# EAGLE design mpcie-breakout (EAGLE 9.6.2)
VERSION: v3.1
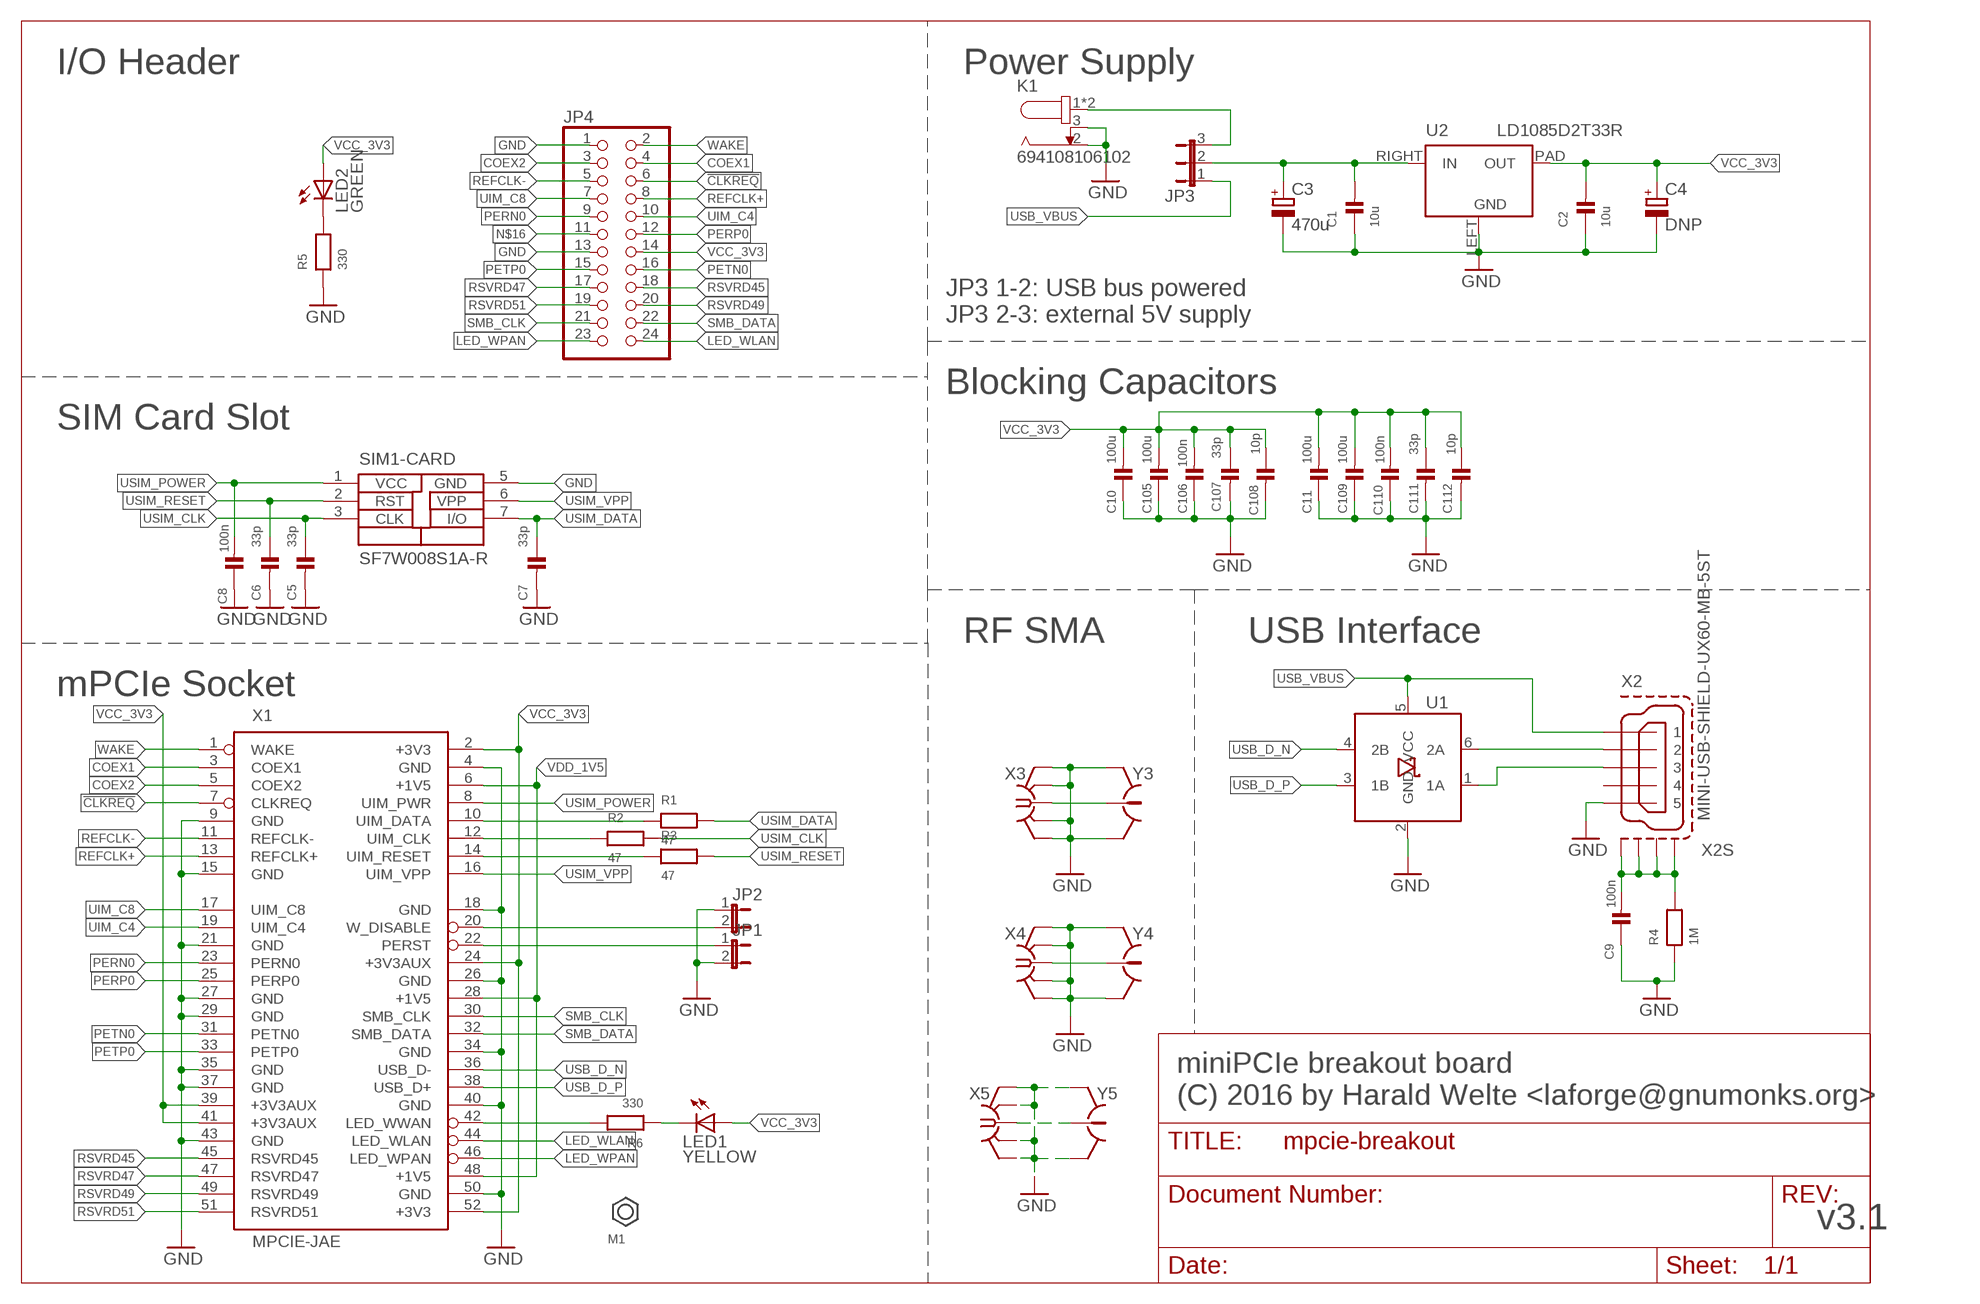
[diagram p0: schematic, sheet 1]
M1 (NUT): CLASS: MECHANICAL; DESCRIPTION: NO DESCRIPTION; LINK: http://www.digikey.com/product-detail/en/jae-electronics/MM60-EZH059-B5-R650/670-2277-1-ND; MANUFACTURER: UNKNOWN MANUFACTURER; MANUFACTURERPARTNUMBER: UNKNOWN MANUFACTURER PART NUMBER; OC_DIGIKEY: H9161CT-ND; POPULATED: TRUE; ROHSCERTIFICATE: UNKNOWN ROHS CERTIFICATE; SCHEM_BOM_ITEM: TRUE; SOURCE: DIGIKEY; SOURCEPARTNUMBER: A97593-ND

## Parts
C1  10u  CAP_CERAMIC_0805  [_0805]
C2  10u  CAP_CERAMIC_0805  [_0805]
C3  470u  CPOL-EUUD-8X10  [UD-8X10_NICHICON]
C4  DNP  CPOL-EUSMCE  [SMC_E]
C5  33p  CAP_CERAMIC_0402  [_0402]
C6  33p  CAP_CERAMIC_0402  [_0402]
C7  33p  CAP_CERAMIC_0402  [_0402]
C8  100n  CAP_CERAMIC_0603  [_0603]
C9  100n  CAP_CERAMIC_0603  [_0603]
C10  100u  CAP_CERAMIC1206  [1206]
C11  100u  CAP_CERAMIC1206  [1206]
C105  100u  CAP_CERAMIC1206  [1206]
C106  100n  CAP_CERAMIC_0603  [_0603]
C107  33p  CAP_CERAMIC_0402  [_0402]
C108  10p  CAP_CERAMIC_0603  [_0603]
C109  100u  CAP_CERAMIC1206  [1206]
C110  100n  CAP_CERAMIC_0603  [_0603]
C111  33p  CAP_CERAMIC_0402  [_0402]
C112  10p  CAP_CERAMIC_0603  [_0603]
JP1  JP1E  [JP1]
JP2  JP1E  [JP1]
JP3  JP2E  [JP2]
JP4  PINHD-2X12  [2X12]
K1  694108106102  [694108106102]
LED1  YELLOW  LEDCHIP-LED0603  [CHIP-LED0603]
LED2  GREEN  LEDCHIP-LED0603  [CHIP-LED0603]
R1  47  RESISTOR_0603  [_0603]
R2  47  RESISTOR_0603  [_0603]
R3  47  RESISTOR_0603  [_0603]
R4  1M  RESISTOR_0603  [_0603]
R5  330  RESISTOR_0603  [_0603]
R6  330  RESISTOR_0603  [_0603]
SIM1  SF7W008S1A-R  [SF7W008S1A-RESTR]
U1  IP4234CZ6  [TSOP-6]
U2  LD1085D2T33R  LDO-LD1085D2  [ST_D2PAK]
X1  MPCIE-JAE  [MM60-52]
X2  MINI-USB-SHIELD-UX60-MB-5ST  [UX60-MB-5ST]
X3  SMA-F-S-TH  [SMA-F-S-TH]
X4  SMA-F-S-TH  [SMA-F-S-TH]
X5  SMA-F-S-TH  [SMA-F-S-TH]
Y3  HRS_UFL  [HRS_UFL]
Y4  HRS_UFL  [HRS_UFL]
Y5  HRS_UFL  [HRS_UFL]

## Nets
!CLKREQ: JP4.6 X1.7(CLKREQ)
_USB_D_N [usb]: U1.6(2A) X2.2
_USB_D_P [usb]: U1.1(1A) X2.3
COEX1: JP4.4 X1.3(COEX1)
COEX2: JP4.3 X1.5(COEX2)
GND [supply]: C1.1 C2.1 C3.- C4.- C5.2 C6.2 C7.2 C8.1 C9.1 C10.1 C11.1 C105.1 C106.1 C107.2 C108.2 C109.1 C110.1 C111.2 C112.2 JP1.2 JP2.1 JP4.1 JP4.13 K1.2 K1.3 R4.1 R5.1 SIM1.5(-CARD:GND) U1.2(GND) U2.LEFT(GND) X1.4(GND) X1.9(GND) X1.15(GND) X1.18(GND) X1.21(GND) X1.26(GND) X1.27(GND) X1.29(GND) X1.34(GND) X1.35(GND) X1.37(GND) X1.40(GND) X1.43(GND) X1.50(GND) X2.5 X3.G1(GND) X3.G2(GND) X3.G3(GND) X3.G4(GND) X4.G1(GND) X4.G2(GND) X4.G3(GND) X4.G4(GND) X5.G1(GND) X5.G2(GND) X5.G3(GND) X5.G4(GND) Y3.GND@1(GND) Y3.GND@2(GND) Y4.GND@1(GND) Y4.GND@2(GND) Y5.GND@1(GND) Y5.GND@2(GND)
LDO_IN [supply]: C1.2 C3.+ JP3.2 U2.RIGHT(IN)
LED_WLAN: JP4.24 X1.44(LED_WLAN)
LED_WPAN: JP4.23 X1.46(LED_WPAN)
N$1: LED2.C R5.2
N$2: LED1.C R6.1
N$3: R6.2 X1.42(LED_WWAN)
N$5: R1.1 X1.10(UIM_DATA)
N$7 [50 ohm]: X5.C Y5.SIG
N$8: R2.1 X1.12(UIM_CLK)
N$9: R3.1 X1.14(UIM_RESET)
N$10: C9.2 R4.2 X2.M1(S1) X2.M2(S2) X2.M3(S3) X2.M4(S4)
N$12 [supply]: JP3.3 K1.1 K1.1-1
N$13 [50 ohm]: X3.C Y3.SIG
N$14 [50 ohm]: X4.C Y4.SIG
N$16: JP4.11
PERN0: JP4.9 X1.23(PERN0)
PERP0: JP4.12 X1.25(PERP0)
PERST: JP1.1 X1.22(PERST)
PETN0: JP4.16 X1.31(PETN0)
PETP0: JP4.15 X1.33(PETP0)
REFCLK+: JP4.8 X1.13(REFCLK+)
REFCLK-: JP4.5 X1.11(REFCLK-)
RSVRD45: JP4.18 X1.45(RSVRD45)
RSVRD47: JP4.17 X1.47(RSVRD47)
RSVRD49: JP4.20 X1.49(RSVRD49)
RSVRD51: JP4.19 X1.51(RSVRD51)
SMB_CLK: JP4.21 X1.30(SMB_CLK)
SMB_DATA: JP4.22 X1.32(SMB_DATA)
UIM_C4: JP4.10 X1.19(UIM_C4)
UIM_C8: JP4.7 X1.17(UIM_C8)
USB_D_N [usb]: U1.4(2B) X1.36(USB_D-)
USB_D_P [usb]: U1.3(1B) X1.38(USB_D+)
USB_VBUS [supply]: JP3.1 U1.5(VCC) X2.1
USIM_CLK: C5.1 R2.2 SIM1.3(-CARD:CLK)
USIM_DATA: C7.1 R1.2 SIM1.7(-CARD:I/O)
USIM_POWER [supply]: C8.2 SIM1.1(-CARD:VCC) X1.8(UIM_PWR)
USIM_RESET: C6.1 R3.2 SIM1.2(-CARD:RST)
USIM_VPP: SIM1.6(-CARD:VPP) X1.16(UIM_VPP)
VCC_3V3 [supply]: C2.2 C4.+ C10.2 C11.2 C105.2 C106.2 C107.1 C108.1 C109.2 C110.2 C111.1 C112.1 JP4.14 LED1.A LED2.A U2.PAD(OUT) X1.2(+3V3) X1.24(+3V3AUX) X1.39(+3V3AUX) X1.41(+3V3AUX) X1.52(+3V3)
VDD_1V5 [supply]: X1.6(+1V5) X1.28(+1V5) X1.48(+1V5)
W_DISABLE: JP2.2 X1.20(W_DISABLE)
WAKE: JP4.2 X1.1(WAKE)
Unconnected: SIM1.81 SIM1.82 X2.4

## Notes on the sheet
- I/O Header | Power Supply
- JP3 1-2: USB bus powered
  JP3 2-3: external 5V supply
- Blocking Capacitors
- SIM Card Slot
- RF SMA | USB Interface
- mPCIe Socket
- miniPCIe breakout board
  (C) 2016 by Harald Welte <laforge@gnumonks.org>

## Library data of the parts
C1 C2 = rc-sysmocom:CAP_CERAMIC: Ceramic Capacitors 0402 - 0402 Surface Mount Capacitors 16pF 50V 5% [Digikey: 445-4899-2-ND] 18pF 50V 5% [Digikey: 490-1281-2-ND] 22pF 50V 5% [Digikey: 490-1283-2-ND] 68pF 50V 5% [Digikey: 490-1289-2-ND] 0.1uF 10V 10% [Digikey: 490-1318-2-ND] 1.0uF 6.3V 10% [Digikey: 490-1320-2-ND] 0603 - 0603 Surface Mount Capacitors 16 pF 50V 5% [Digikey: 445-5051-2-ND] 22 pF 50V [Digikey: PCC220ACVTR-ND] 33 pF 50V 5% [Digikey: 490-1415-1-ND] 56pF 50V 5% [Digikey: 490-1421-1-ND] 220pF 50V 5% [Digikey: 445-1285-1-ND] 680 pF 50V 2200 pF 50V 5% C0G [Digikey: 445-1297-1-ND] 5600 pF 100V 5% X7R [Digikey: 478-3711-1-ND] 0.1 µF 25V 10% [Digikey: PCC2277TR-ND] 0.22 µF 16V 10% X7R [Digikey: 445-1318-1-ND] 1.0 µF 25V 10% [Digikey: 445-5146-2-ND] 0603 - RF Specific 3pF 250V +/-0.1pF RF [Digikey: 712-1347-1-ND] 18 pF 250V 5% [Digikey: 478-3505-1-ND or 712-1322-1-ND] 56 pF 250V 5% C0G RF [Digikey: 490-4867-1-ND] 68 pF 250V RF [Digikey: 490-4868-1-ND] 0805 - 0805 Surface Mount Capacitors 220 pF 250V 2% RF Ceramic Capacitor [Digikey: 712-1398-1-ND] 1000 pF 50V 2% NP0 Ceramic Capacitor [Digikey: 478-3760-1-ND] 0.1 µF 25V 10% Ceramic Capacitor [Digikey: PCC1828TR-ND] 1.0 µF 16V 10% Ceramic Capacitor[Digikey: 490-1691-2-ND] 10.0 µF 10V 10% Ceramic Capacitor[Digikey: 709-1228-1-ND] 10.0 uF 16V 10% Ceramic Capacitor [Digikey: 478-5165-2-ND] 47 uF 6.3V 20% Ceramic Capacitor [Digikey: 587-1779-1-ND or 399-5506-1-ND] 1206 - 1206 Surface Mount Capacitors 47uF 10V 20% Ceramic Capacitor [Digikey: 490-5528-1-ND or 399-5508-1-ND or 445-6010-1-ND] 100uF 6.3V -20%, +80% Y5V Ceramic Capacitor (Digikey: 490-4512-1-ND, Mouser: 81-GRM31CF50J107ZE1L) 1810 - 1810 Surface Mount Capacitors High volt MLC; no solder stop between for higher isolation; CLASS: CAPACITOR; DESCRIPTION: 10µF 16V Ceramic Capacitor X5R 0805 (2012 Metric) 0.079" L x 0.049" W (2.00mm x 1.25mm); LINK: http://www.digikey.com/product-detail/en/samsung-electro-mechanics-america-inc/CL21A106KOQNNNG/1276-6455-1-ND/5958083; MANUFACTURER: Samsung Electro-Mechanics America, Inc.; MANUFACTURERPARTNUMBER: CL21A106KOQNNNG; POPULATED: TRUE; ROHSCERTIFICATE: UNKNOWN ROHS CERTIFICATE; SOURCE: DIGIKEY; SOURCEPARTNUMBER: 1276-6455-1-ND
C3 = rcl:CPOL-EU: POLARIZED CAPACITOR, European symbol; CLASS: CAPACITOR; DESCRIPTION: 470µF 6.3V Aluminum Capacitors Radial, Can - SMD 2000 Hrs @ 85°C; LINK: http://www.digikey.com/product-detail/en/nichicon/UUR0J471MNL1GS/493-6207-1-ND/3438720; MANUFACTURER: Nichicon; MANUFACTURERPARTNUMBER: UUR0J471MNL1GS; POPULATED: TRUE; ROHSCERTIFICATE: UNKNOWN ROHS CERTIFICATE; SOURCE: DIGIKEY; SOURCEPARTNUMBER: 493-6207-1-ND
C4 = rcl:CPOL-EU: POLARIZED CAPACITOR, European symbol; CLASS: CAPACITOR; DESCRIPTION: NO DESCRIPTION; LINK: UNKNOWN LINK; MANUFACTURER: UNKNOWN MANUFACTURER; MANUFACTURERPARTNUMBER: UNKNOWN MANUFACTURER PART NUMBER; POPULATED: FALSE; ROHSCERTIFICATE: UNKNOWN ROHS CERTIFICATE; SOURCE: UNKNOWN SOURCE; SOURCEPARTNUMBER: UNKNOWN SOURCE PART NUMBER
C5-C7 C107 C111 = rc-sysmocom:CAP_CERAMIC: Ceramic Capacitors 0402 - 0402 Surface Mount Capacitors 16pF 50V 5% [Digikey: 445-4899-2-ND] 18pF 50V 5% [Digikey: 490-1281-2-ND] 22pF 50V 5% [Digikey: 490-1283-2-ND] 68pF 50V 5% [Digikey: 490-1289-2-ND] 0.1uF 10V 10% [Digikey: 490-1318-2-ND] 1.0uF 6.3V 10% [Digikey: 490-1320-2-ND] 0603 - 0603 Surface Mount Capacitors 16 pF 50V 5% [Digikey: 445-5051-2-ND] 22 pF 50V [Digikey: PCC220ACVTR-ND] 33 pF 50V 5% [Digikey: 490-1415-1-ND] 56pF 50V 5% [Digikey: 490-1421-1-ND] 220pF 50V 5% [Digikey: 445-1285-1-ND] 680 pF 50V 2200 pF 50V 5% C0G [Digikey: 445-1297-1-ND] 5600 pF 100V 5% X7R [Digikey: 478-3711-1-ND] 0.1 µF 25V 10% [Digikey: PCC2277TR-ND] 0.22 µF 16V 10% X7R [Digikey: 445-1318-1-ND] 1.0 µF 25V 10% [Digikey: 445-5146-2-ND] 0603 - RF Specific 3pF 250V +/-0.1pF RF [Digikey: 712-1347-1-ND] 18 pF 250V 5% [Digikey: 478-3505-1-ND or 712-1322-1-ND] 56 pF 250V 5% C0G RF [Digikey: 490-4867-1-ND] 68 pF 250V RF [Digikey: 490-4868-1-ND] 0805 - 0805 Surface Mount Capacitors 220 pF 250V 2% RF Ceramic Capacitor [Digikey: 712-1398-1-ND] 1000 pF 50V 2% NP0 Ceramic Capacitor [Digikey: 478-3760-1-ND] 0.1 µF 25V 10% Ceramic Capacitor [Digikey: PCC1828TR-ND] 1.0 µF 16V 10% Ceramic Capacitor[Digikey: 490-1691-2-ND] 10.0 µF 10V 10% Ceramic Capacitor[Digikey: 709-1228-1-ND] 10.0 uF 16V 10% Ceramic Capacitor [Digikey: 478-5165-2-ND] 47 uF 6.3V 20% Ceramic Capacitor [Digikey: 587-1779-1-ND or 399-5506-1-ND] 1206 - 1206 Surface Mount Capacitors 47uF 10V 20% Ceramic Capacitor [Digikey: 490-5528-1-ND or 399-5508-1-ND or 445-6010-1-ND] 100uF 6.3V -20%, +80% Y5V Ceramic Capacitor (Digikey: 490-4512-1-ND, Mouser: 81-GRM31CF50J107ZE1L) 1810 - 1810 Surface Mount Capacitors High volt MLC; no solder stop between for higher isolation; CLASS: CAPACITOR; DESCRIPTION: CAP CER 33PF 50V NP0 0402; LINK: http://www.digikey.com/product-detail/en/CL05C330JB5NNNC/1276-1272-1-ND/3889358; MANUFACTURER: Samsung Electro-Mechanics America, Inc.; MANUFACTURERPARTNUMBER: CL05C330JB5NNNC; POPULATED: TRUE; ROHSCERTIFICATE: Bleifrei / RoHS-konform; SOURCE: DIGIKEY; SOURCEPARTNUMBER: 1276-1272-1-ND
C8 C9 C106 C110 = rc-sysmocom:CAP_CERAMIC: Ceramic Capacitors 0402 - 0402 Surface Mount Capacitors 16pF 50V 5% [Digikey: 445-4899-2-ND] 18pF 50V 5% [Digikey: 490-1281-2-ND] 22pF 50V 5% [Digikey: 490-1283-2-ND] 68pF 50V 5% [Digikey: 490-1289-2-ND] 0.1uF 10V 10% [Digikey: 490-1318-2-ND] 1.0uF 6.3V 10% [Digikey: 490-1320-2-ND] 0603 - 0603 Surface Mount Capacitors 16 pF 50V 5% [Digikey: 445-5051-2-ND] 22 pF 50V [Digikey: PCC220ACVTR-ND] 33 pF 50V 5% [Digikey: 490-1415-1-ND] 56pF 50V 5% [Digikey: 490-1421-1-ND] 220pF 50V 5% [Digikey: 445-1285-1-ND] 680 pF 50V 2200 pF 50V 5% C0G [Digikey: 445-1297-1-ND] 5600 pF 100V 5% X7R [Digikey: 478-3711-1-ND] 0.1 µF 25V 10% [Digikey: PCC2277TR-ND] 0.22 µF 16V 10% X7R [Digikey: 445-1318-1-ND] 1.0 µF 25V 10% [Digikey: 445-5146-2-ND] 0603 - RF Specific 3pF 250V +/-0.1pF RF [Digikey: 712-1347-1-ND] 18 pF 250V 5% [Digikey: 478-3505-1-ND or 712-1322-1-ND] 56 pF 250V 5% C0G RF [Digikey: 490-4867-1-ND] 68 pF 250V RF [Digikey: 490-4868-1-ND] 0805 - 0805 Surface Mount Capacitors 220 pF 250V 2% RF Ceramic Capacitor [Digikey: 712-1398-1-ND] 1000 pF 50V 2% NP0 Ceramic Capacitor [Digikey: 478-3760-1-ND] 0.1 µF 25V 10% Ceramic Capacitor [Digikey: PCC1828TR-ND] 1.0 µF 16V 10% Ceramic Capacitor[Digikey: 490-1691-2-ND] 10.0 µF 10V 10% Ceramic Capacitor[Digikey: 709-1228-1-ND] 10.0 uF 16V 10% Ceramic Capacitor [Digikey: 478-5165-2-ND] 47 uF 6.3V 20% Ceramic Capacitor [Digikey: 587-1779-1-ND or 399-5506-1-ND] 1206 - 1206 Surface Mount Capacitors 47uF 10V 20% Ceramic Capacitor [Digikey: 490-5528-1-ND or 399-5508-1-ND or 445-6010-1-ND] 100uF 6.3V -20%, +80% Y5V Ceramic Capacitor (Digikey: 490-4512-1-ND, Mouser: 81-GRM31CF50J107ZE1L) 1810 - 1810 Surface Mount Capacitors High volt MLC; no solder stop between for higher isolation; CLASS: CAPACITOR; DESCRIPTION: CAP CER 0.1UF 16V 10% X7R 0603; LINK: http://www.digikey.com/product-detail/en/foo/1276-1005-1-ND; MANUFACTURER: Samsung Electro-Mechanics America, Inc; MANUFACTURERPARTNUMBER: CL10B104KO8NNNC; POPULATED: TRUE; ROHSCERTIFICATE: Bleifrei / RoHS-konform; SOURCE: DIGIKEY; SOURCEPARTNUMBER: 1276-1005-1-ND
C10 C11 C105 C109 = rc-sysmocom:CAP_CERAMIC: Ceramic Capacitors 0402 - 0402 Surface Mount Capacitors 16pF 50V 5% [Digikey: 445-4899-2-ND] 18pF 50V 5% [Digikey: 490-1281-2-ND] 22pF 50V 5% [Digikey: 490-1283-2-ND] 68pF 50V 5% [Digikey: 490-1289-2-ND] 0.1uF 10V 10% [Digikey: 490-1318-2-ND] 1.0uF 6.3V 10% [Digikey: 490-1320-2-ND] 0603 - 0603 Surface Mount Capacitors 16 pF 50V 5% [Digikey: 445-5051-2-ND] 22 pF 50V [Digikey: PCC220ACVTR-ND] 33 pF 50V 5% [Digikey: 490-1415-1-ND] 56pF 50V 5% [Digikey: 490-1421-1-ND] 220pF 50V 5% [Digikey: 445-1285-1-ND] 680 pF 50V 2200 pF 50V 5% C0G [Digikey: 445-1297-1-ND] 5600 pF 100V 5% X7R [Digikey: 478-3711-1-ND] 0.1 µF 25V 10% [Digikey: PCC2277TR-ND] 0.22 µF 16V 10% X7R [Digikey: 445-1318-1-ND] 1.0 µF 25V 10% [Digikey: 445-5146-2-ND] 0603 - RF Specific 3pF 250V +/-0.1pF RF [Digikey: 712-1347-1-ND] 18 pF 250V 5% [Digikey: 478-3505-1-ND or 712-1322-1-ND] 56 pF 250V 5% C0G RF [Digikey: 490-4867-1-ND] 68 pF 250V RF [Digikey: 490-4868-1-ND] 0805 - 0805 Surface Mount Capacitors 220 pF 250V 2% RF Ceramic Capacitor [Digikey: 712-1398-1-ND] 1000 pF 50V 2% NP0 Ceramic Capacitor [Digikey: 478-3760-1-ND] 0.1 µF 25V 10% Ceramic Capacitor [Digikey: PCC1828TR-ND] 1.0 µF 16V 10% Ceramic Capacitor[Digikey: 490-1691-2-ND] 10.0 µF 10V 10% Ceramic Capacitor[Digikey: 709-1228-1-ND] 10.0 uF 16V 10% Ceramic Capacitor [Digikey: 478-5165-2-ND] 47 uF 6.3V 20% Ceramic Capacitor [Digikey: 587-1779-1-ND or 399-5506-1-ND] 1206 - 1206 Surface Mount Capacitors 47uF 10V 20% Ceramic Capacitor [Digikey: 490-5528-1-ND or 399-5508-1-ND or 445-6010-1-ND] 100uF 6.3V -20%, +80% Y5V Ceramic Capacitor (Digikey: 490-4512-1-ND, Mouser: 81-GRM31CF50J107ZE1L) 1810 - 1810 Surface Mount Capacitors High volt MLC; no solder stop between for higher isolation; CLASS: CAPACITOR; DESCRIPTION: 100µF 6.3V Ceramic Capacitor X5R 1206 (3216 Metric) 0.126" L x 0.063" W (3.20mm x 1.60mm); LINK: http://www.digikey.com/product-detail/en/murata-electronics-north-america/GRM31CR60J107ME39K/490-7217-1-ND/3991203; MANUFACTURER: Murata Electronics North America; MANUFACTURERPARTNUMBER: GRM31CR60J107ME39K; POPULATED: TRUE; ROHSCERTIFICATE: UNKNOWN ROHS CERTIFICATE; SOURCE: DIGIKEY; SOURCEPARTNUMBER: 490-7217-1-ND
C108 C112 = rc-sysmocom:CAP_CERAMIC: Ceramic Capacitors 0402 - 0402 Surface Mount Capacitors 16pF 50V 5% [Digikey: 445-4899-2-ND] 18pF 50V 5% [Digikey: 490-1281-2-ND] 22pF 50V 5% [Digikey: 490-1283-2-ND] 68pF 50V 5% [Digikey: 490-1289-2-ND] 0.1uF 10V 10% [Digikey: 490-1318-2-ND] 1.0uF 6.3V 10% [Digikey: 490-1320-2-ND] 0603 - 0603 Surface Mount Capacitors 16 pF 50V 5% [Digikey: 445-5051-2-ND] 22 pF 50V [Digikey: PCC220ACVTR-ND] 33 pF 50V 5% [Digikey: 490-1415-1-ND] 56pF 50V 5% [Digikey: 490-1421-1-ND] 220pF 50V 5% [Digikey: 445-1285-1-ND] 680 pF 50V 2200 pF 50V 5% C0G [Digikey: 445-1297-1-ND] 5600 pF 100V 5% X7R [Digikey: 478-3711-1-ND] 0.1 µF 25V 10% [Digikey: PCC2277TR-ND] 0.22 µF 16V 10% X7R [Digikey: 445-1318-1-ND] 1.0 µF 25V 10% [Digikey: 445-5146-2-ND] 0603 - RF Specific 3pF 250V +/-0.1pF RF [Digikey: 712-1347-1-ND] 18 pF 250V 5% [Digikey: 478-3505-1-ND or 712-1322-1-ND] 56 pF 250V 5% C0G RF [Digikey: 490-4867-1-ND] 68 pF 250V RF [Digikey: 490-4868-1-ND] 0805 - 0805 Surface Mount Capacitors 220 pF 250V 2% RF Ceramic Capacitor [Digikey: 712-1398-1-ND] 1000 pF 50V 2% NP0 Ceramic Capacitor [Digikey: 478-3760-1-ND] 0.1 µF 25V 10% Ceramic Capacitor [Digikey: PCC1828TR-ND] 1.0 µF 16V 10% Ceramic Capacitor[Digikey: 490-1691-2-ND] 10.0 µF 10V 10% Ceramic Capacitor[Digikey: 709-1228-1-ND] 10.0 uF 16V 10% Ceramic Capacitor [Digikey: 478-5165-2-ND] 47 uF 6.3V 20% Ceramic Capacitor [Digikey: 587-1779-1-ND or 399-5506-1-ND] 1206 - 1206 Surface Mount Capacitors 47uF 10V 20% Ceramic Capacitor [Digikey: 490-5528-1-ND or 399-5508-1-ND or 445-6010-1-ND] 100uF 6.3V -20%, +80% Y5V Ceramic Capacitor (Digikey: 490-4512-1-ND, Mouser: 81-GRM31CF50J107ZE1L) 1810 - 1810 Surface Mount Capacitors High volt MLC; no solder stop between for higher isolation; CLASS: CAPACITOR; DESCRIPTION: CAP CER 10PF 50V NP0 0603; LINK: http://www.digikey.com/product-detail/en/C0603C100J5GACTU/399-1049-1-ND; MANUFACTURER: Kemet; MANUFACTURERPARTNUMBER: C0603C100J5GACTU; POPULATED: TRUE; ROHSCERTIFICATE: Bleifrei / RoHS-konform; SOURCE: DIGIKEY; SOURCEPARTNUMBER: 399-1049-1-ND
JP1 JP2 = jumper:JP1E: JUMPER; CLASS: CONNECTOR\JUMPER; DESCRIPTION: NO DESCRIPTION; LINK: UNKNOWN LINK; MANUFACTURER: UNKNOWN MANUFACTURER; MANUFACTURERPARTNUMBER: UNKNOWN MANUFACTURER PART NUMBER; POPULATED: TRUE; ROHSCERTIFICATE: UNKNOWN ROHS CERTIFICATE; SOURCE: UNKNOWN SOURCE; SOURCEPARTNUMBER: UNKNOWN SOURCE PART NUMBER
JP3 = jumper:JP2E: JUMPER; CLASS: CONNECTOR\JUMPER; DESCRIPTION: NO DESCRIPTION; LINK: UNKNOWN LINK; MANUFACTURER: UNKNOWN MANUFACTURER; MANUFACTURERPARTNUMBER: UNKNOWN MANUFACTURER PART NUMBER; POPULATED: TRUE; ROHSCERTIFICATE: UNKNOWN ROHS CERTIFICATE; SOURCE: UNKNOWN SOURCE; SOURCEPARTNUMBER: UNKNOWN SOURCE PART NUMBER
JP4 = pinhead:PINHD-2X12: PIN HEADER; CLASS: CONNECTOR\JUMPER; DESCRIPTION: 24 Positions Header, Unshrouded Connector 0.100" (2.54mm) Through Hole Gold; LINK: http://www.digikey.com/product-detail/en/961224-6404-AR/3M9463-ND/2071504; MANUFACTURER: 3M; MANUFACTURERPARTNUMBER: 961224-6404-AR; POPULATED: TRUE; ROHSCERTIFICATE: UNKNOWN ROHS CERTIFICATE; SOURCE: DIGIKEY; SOURCEPARTNUMBER: 3M9463-ND
K1 = Wurth_Elektronik_Electromechanic_DC_Power_Jack_Connectors_rev15c:694108106102: WR-DC_DC Power Jack_Right Angled_SMT Center Pin Ø2.5_Plug ID Ø2.55_Plug OD Ø5.5_with 4 Soldering Pad & Peg ;=>Code : Con_WR-DC_SMT_694108106102_694108106102 <http://katalog.we-online.de/media/images/eican/Con_WR-DC_SMT_694108106102_pf2.jpg> Details see: http://katalog.we-online.de/em/datasheet/6941xx106102.pdf Created 2014-10-08, Karrer Zheng 2014 (C) Wurth Elektronik; CLASS: RELAY; DESCRIPTION: Power Barrel Connector Jack 2.50mm ID (0.098"), 5.50mm OD (0.217") Surface Mount, Right Angle; LINK: http://www.digikey.com/product-detail/en/wurth-electronics-inc/694108106102/732-5933-1-ND/5047628; MANUFACTURER: Wurth Electronics Inc; MANUFACTURERPARTNUMBER: 694108106102; POPULATED: TRUE; ROHSCERTIFICATE: UNKNOWN ROHS CERTIFICATE; SOURCE: DIGIKEY; SOURCEPARTNUMBER: 732-5933-1-ND
LED1 LED2 = led:LED: LED OSRAM: - CHIPLED LG R971, LG N971, LY N971, LG Q971, LY Q971, LO R971, LY R971 LH N974, LH R974 LS Q976, LO Q976, LY Q976 LO Q996 - Hyper CHIPLED LW Q18S LB Q993, LB Q99A, LB R99A - SideLED LS A670, LO A670, LY A670, LG A670, LP A670 LB A673, LV A673, LT A673, LW A673 LH A674 LY A675 LS A676, LA A676, LO A676, LY A676, LW A676 LS A679, LY A679, LG A679 - Hyper Micro SIDELED® LS Y876, LA Y876, LO Y876, LY Y876 LT Y87S - SmartLED LW L88C, LW L88S LB L89C, LB L89S, LG L890 LS L89K, LO L89K, LY L89K LS L896, LA L896, LO L896, LY L896 - TOPLED LS T670, LO T670, LY T670, LG T670, LP T670 LSG T670, LSP T670, LSY T670, LOP T670, LYG T670 LG T671, LOG T671, LSG T671 LB T673, LV T673, LT T673, LW T673 LH T674 LS T676, LA T676, LO T676, LY T676, LB T676, LH T676, LSB T676, LW T676 LB T67C, LV T67C, LT T67C, LS T67K, LO T67K, LY T67K, LW E67C LS E67B, LA E67B, LO E67B, LY E67B, LB E67C, LV E67C, LT E67C LW T67C LS T679, LY T679, LG T679 LS T770, LO T770, LY T770, LG T770, LP T770 LB T773, LV T773, LT T773, LW T773 LH T774 LS E675, LA E675, LY E675, LS T675 LS T776, LA T776, LO T776, LY T776, LB T776 LHGB T686 LT T68C, LB T68C - Hyper Mini TOPLED® LB M676 - Mini TOPLED Santana® LG M470 LS M47K, LO M47K, LY M47K Source: http://www.osram.convergy.de LUXEON: - LUMILED® LXK2-PW12-R00, LXK2-PW12-S00, LXK2-PW14-U00, LXK2-PW14-V00 LXK2-PM12-R00, LXK2-PM12-S00, LXK2-PM14-U00 LXK2-PE12-Q00, LXK2-PE12-R00, LXK2-PE12-S00, LXK2-PE14-T00, LXK2-PE14-U00 LXK2-PB12-K00, LXK2-PB12-L00, LXK2-PB12-M00, LXK2-PB14-N00, LXK2-PB14-P00, LXK2-PB14-Q00 LXK2-PR12-L00, LXK2-PR12-M00, LXK2-PR14-Q00, LXK2-PR14-R00 LXK2-PD12-Q00, LXK2-PD12-R00, LXK2-PD12-S00 LXK2-PH12-R00, LXK2-PH12-S00 LXK2-PL12-P00, LXK2-PL12-Q00, LXK2-PL12-R00 Source: www.luxeon.com KINGBRIGHT: KA-3528ASYC Source: www.kingbright.com; CLASS: LED; DESCRIPTION: NO DESCRIPTION; LINK: UNKNOWN LINK; MANUFACTURER: UNKNOWN MANUFACTURER; MANUFACTURERPARTNUMBER: UNKNOWN MANUFACTURER PART NUMBER; POPULATED: TRUE; ROHSCERTIFICATE: UNKNOWN ROHS CERTIFICATE; SOURCE: UNKNOWN SOURCE; SOURCEPARTNUMBER: UNKNOWN SOURCE PART NUMBER
R1-R3 = rc-sysmocom:RESISTOR: Resistors 0402 - 0402 Surface Mount Package 22 Ohm 1% 1/16W [Digikey: 311-22.0LRTR-ND] 33 Ohm 5% 1/16W 1.0K 5% 1/16W 1.5K 5% 1/16W 2.0K 1% 1/16W 10.0K 1% 1/16W [Digikey: 311-10.0KLRTR-ND] 10.0K 5% 1/16W [Digikey: RMCF0402JT10K0TR-ND] 12.1K 1% 1/16W [Digikey: 311-22.0LRTR-ND] 100.0K 5% 1/16W 0603 - 0603 Surface Mount Package 1/10 Watt 0805 - 0805 Surface Mount Package 1/8 Watt 1206 - 1206 Surface Mount Package 2012 - 2010 Surface Mount Package 0.11 Ohm 1/2 Watt 1% Resistor - Digikey: RHM.11UCT-ND; CLASS: RESISTOR; DESCRIPTION: RES SMD 47 OHM 5% 1/10W 0603; LINK: http://www.digikey.com/product-detail/en/yageo/RC0603JR-0747RL/311-47GRCT-ND/729740; MANUFACTURER: Yageo; MANUFACTURERPARTNUMBER: RC0603JR-0747RL; POPULATED: TRUE; ROHSCERTIFICATE: UNKNOWN ROHS CERTIFICATE; SOURCE: DIGIKEY; SOURCEPARTNUMBER: 311-47GRCT-ND
R4 = rc-sysmocom:RESISTOR: Resistors 0402 - 0402 Surface Mount Package 22 Ohm 1% 1/16W [Digikey: 311-22.0LRTR-ND] 33 Ohm 5% 1/16W 1.0K 5% 1/16W 1.5K 5% 1/16W 2.0K 1% 1/16W 10.0K 1% 1/16W [Digikey: 311-10.0KLRTR-ND] 10.0K 5% 1/16W [Digikey: RMCF0402JT10K0TR-ND] 12.1K 1% 1/16W [Digikey: 311-22.0LRTR-ND] 100.0K 5% 1/16W 0603 - 0603 Surface Mount Package 1/10 Watt 0805 - 0805 Surface Mount Package 1/8 Watt 1206 - 1206 Surface Mount Package 2012 - 2010 Surface Mount Package 0.11 Ohm 1/2 Watt 1% Resistor - Digikey: RHM.11UCT-ND; CLASS: RESISTOR; DESCRIPTION: RES SMD 1M OHM 5% 1/10W 0603; LINK: http://www.digikey.com/product-detail/en/yageo/RC0603JR-071ML/311-1.0MGRCT-ND/729625; MANUFACTURER: Yageo; MANUFACTURERPARTNUMBER: RC0603JR-071ML; POPULATED: TRUE; ROHSCERTIFICATE: UNKNOWN ROHS CERTIFICATE; SOURCE: DIGIKEY; SOURCEPARTNUMBER: 311-1.0MGRCT-ND
R5 R6 = rc-sysmocom:RESISTOR: Resistors 0402 - 0402 Surface Mount Package 22 Ohm 1% 1/16W [Digikey: 311-22.0LRTR-ND] 33 Ohm 5% 1/16W 1.0K 5% 1/16W 1.5K 5% 1/16W 2.0K 1% 1/16W 10.0K 1% 1/16W [Digikey: 311-10.0KLRTR-ND] 10.0K 5% 1/16W [Digikey: RMCF0402JT10K0TR-ND] 12.1K 1% 1/16W [Digikey: 311-22.0LRTR-ND] 100.0K 5% 1/16W 0603 - 0603 Surface Mount Package 1/10 Watt 0805 - 0805 Surface Mount Package 1/8 Watt 1206 - 1206 Surface Mount Package 2012 - 2010 Surface Mount Package 0.11 Ohm 1/2 Watt 1% Resistor - Digikey: RHM.11UCT-ND; CLASS: RESISTOR; DESCRIPTION: RES SMD 330 OHM 5% 1/10W 0603; LINK: http://www.digikey.com/product-detail/en/yageo/RC0603JR-07330RL/311-330GRCT-ND/729716; MANUFACTURER: Yageo; MANUFACTURERPARTNUMBER: RC0603JR-07330RL; POPULATED: TRUE; ROHSCERTIFICATE: UNKNOWN ROHS CERTIFICATE; SOURCE: DIGIKEY; SOURCEPARTNUMBER: 311-330GRCT-ND
SIM1 = SF7W008S1A-SIM:SF7W008S1A: JAE SIM card holder with lock and card detect switch; CLASS: UNKNOWN CLASS; DESCRIPTION: 8 (6 + 2) Position Card Connector SIM Card Surface Mount, Right Angle Gold; LINK: http://www.digikey.com/product-detail/en/jae-electronics/SF7W008S1AE900/670-2337-1-ND/1284033; MANUFACTURER: JAE Electronics; MANUFACTURERPARTNUMBER: SF7W008S1AE900; OC_DIGIKEY: 670-2337-1-ND; POPULATED: TRUE; ROHSCERTIFICATE: UNKNOWN ROHS CERTIFICATE; SOURCE: DIGIKEY; SOURCEPARTNUMBER: 670-2337-1-ND
U1 = laforge:IP4234CZ6: NXP IP4234CZ6 - Single USB 2.0 ESD protection to IEC 61000-4-2 level 4; CLASS: IC; DESCRIPTION: TVS DIODE 5.5VWM 6TSOP; LINK: http://www.digikey.com/product-detail/en/nxp-semiconductors/IP4234CZ6,125/568-5869-1-ND/2531156; MANUFACTURER: NXP Semiconductors; MANUFACTURERPARTNUMBER: IP4234CZ6,125; OC_DIGIKEY: 568-5869-1-ND; POPULATED: TRUE; ROHSCERTIFICATE: UNKNOWN ROHS CERTIFICATE; SOURCE: DIGIKEY; SOURCEPARTNUMBER: 568-5869-1-ND
U2 = ldo:LDO; CLASS: IC; DESCRIPTION: Linear Voltage Regulator IC Positive Fixed 1 Output 3.3V 3A D2PAK; LINK: http://www.digikey.com/product-detail/en/stmicroelectronics/LD1085D2T33R/497-1222-1-ND/586222; MANUFACTURER: STMicroelectronics; MANUFACTURERPARTNUMBER: LD1085D2T33R; POPULATED: TRUE; ROHSCERTIFICATE: UNKNOWN ROHS CERTIFICATE; SOURCE: DIGIKEY; SOURCEPARTNUMBER: 497-1222-1-ND
X1 = con-miniPCIe:MPCIE; CLASS: CONNECTOR; DESCRIPTION: CONN MINI EXPRESS CARD 52POS SMD; LINK: http://www.digikey.com/product-detail/en/jae-electronics/MM60-52B1-E1-R650/670-2275-1-ND; MANUFACTURER: JAE Electronics; MANUFACTURERPARTNUMBER: MM60-52B1-E1-R650; POPULATED: TRUE; ROHSCERTIFICATE: UNKNOWN ROHS CERTIFICATE; SOURCE: DIGIKEY; SOURCEPARTNUMBER: 670-2275-1-ND
X2 = con-hirose:MINI-USB-SHIELD-: MINI USB Connector Source: http://www.hirose.co.jp/cataloge_hp/e24000019.pdf; CLASS: CONNECTOR; DESCRIPTION: USB - mini B USB 2.0 Receptacle Connector 5 Position Surface Mount, Right Angle, Horizontal; LINK: http://www.digikey.com/product-detail/en/hirose-electric-co-ltd/UX60-MB-5ST/H2959CT-ND/597538; MANUFACTURER: Hirose Electric Co Ltd; MANUFACTURERPARTNUMBER: UX60-MB-5ST; OC_FARNELL: unknown; OC_NEWARK: unknown; POPULATED: TRUE; ROHSCERTIFICATE: UNKNOWN ROHS CERTIFICATE; SOURCE: DIGIKEY; SOURCEPARTNUMBER: H2959CT-ND
X3-X5 = laforge:SMA-F; CLASS: CONNECTOR; DESCRIPTION: CONN SMA JACK STR 50 OHM PCB; LINK: http://www.digikey.com/product-detail/en/te-connectivity-amp-connectors/5-1814832-1/A97594-ND/1755982; MANUFACTURER: TE Connectivity AMP Connectors; MANUFACTURERPARTNUMBER: 5-1814832-1; POPULATED: TRUE; ROHSCERTIFICATE: UNKNOWN ROHS CERTIFICATE; SOURCE: DIGIKEY; SOURCEPARTNUMBER: A97594-ND
Y3-Y5 = laforge:HRS_UFL: Hirose U.FL SMT; CLASS: UNKNOWN CLASS; DESCRIPTION: CONN UMC RCPT STR 50 OHM SMD; LINK: http://www.digikey.com/product-detail/en/hirose-electric-co-ltd/U.FL-R-SMT(01)/H9161-ND/513010; MANUFACTURER: Hirose Electric Co Ltd; MANUFACTURERPARTNUMBER: U.FL-R-SMT(01); OC_DIGIKEY: H9161CT-ND; POPULATED: TRUE; ROHSCERTIFICATE: UNKNOWN ROHS CERTIFICATE; SOURCE: DIGIKEY; SOURCEPARTNUMBER: H9161-ND

## Net classes
1 usb: width 0.5 mm, drill 0.15 mm
2 50 ohm: width 0.9 mm, clearance 0.152 mm
3 supply: width 0.6 mm, clearance 0.203 mm

## Board
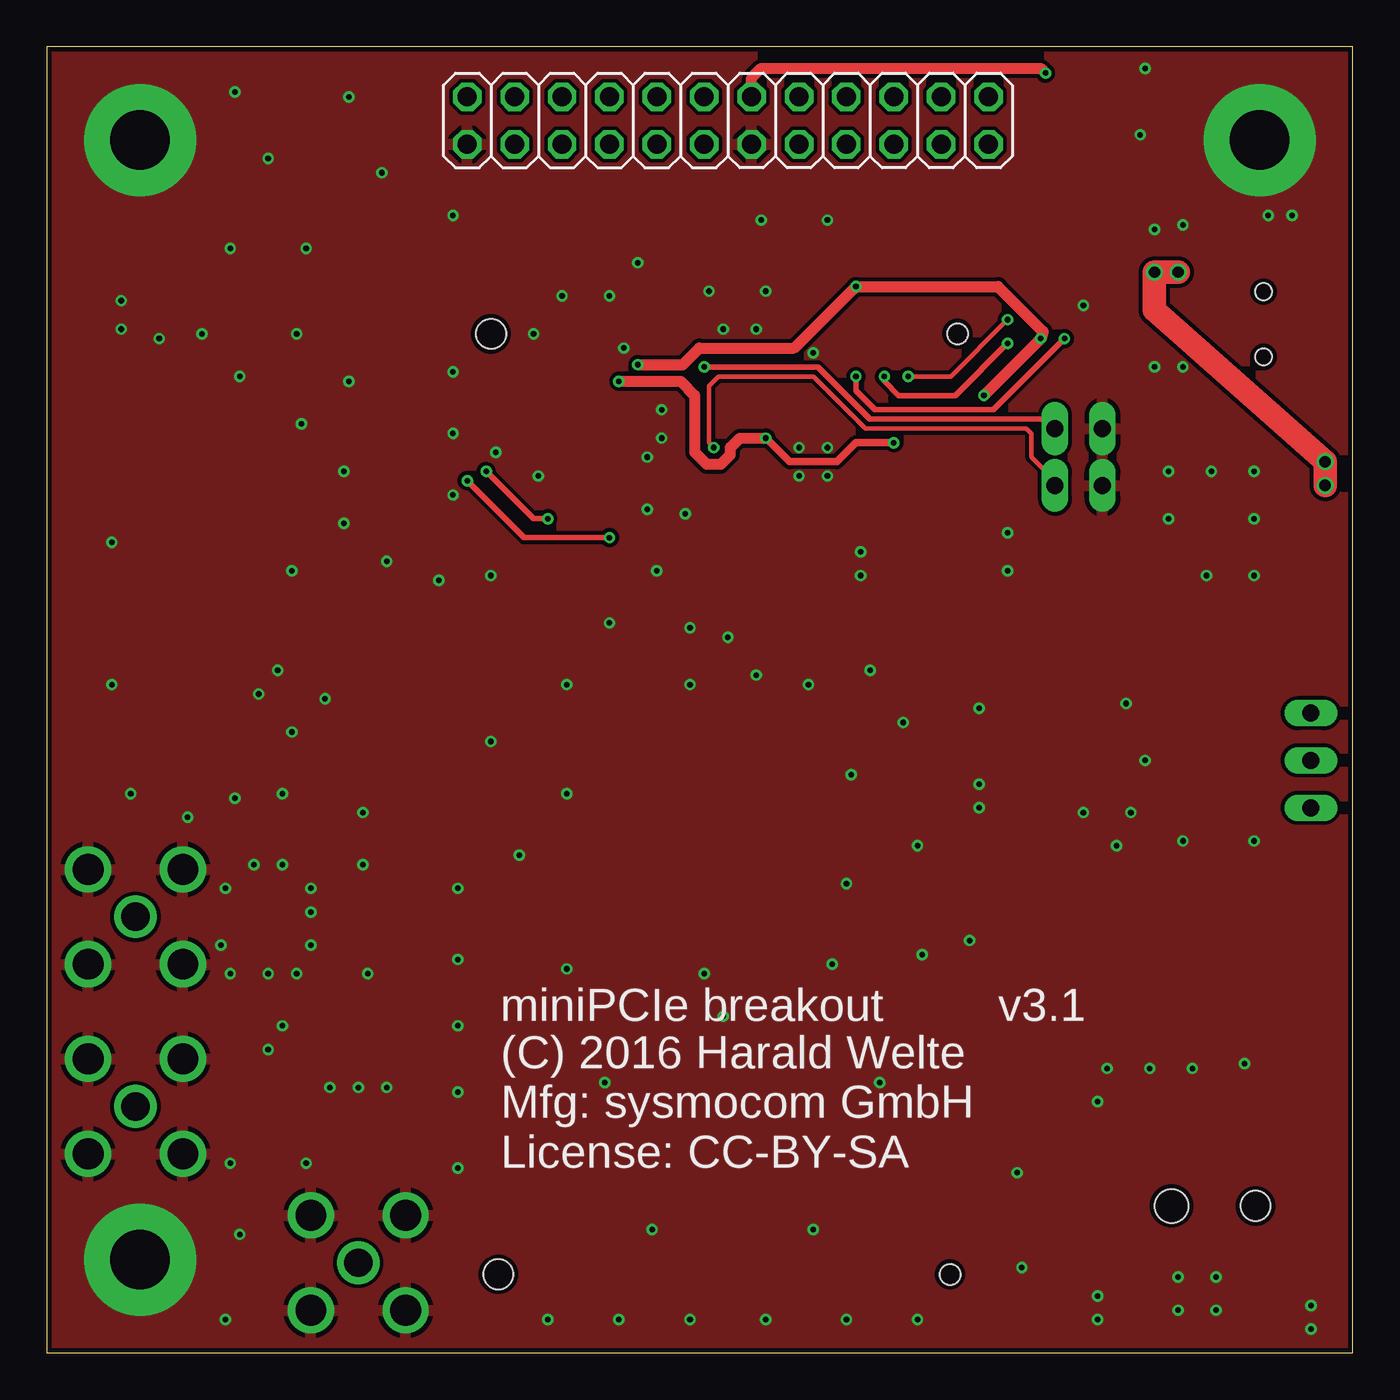
[diagram p1: board, top side]
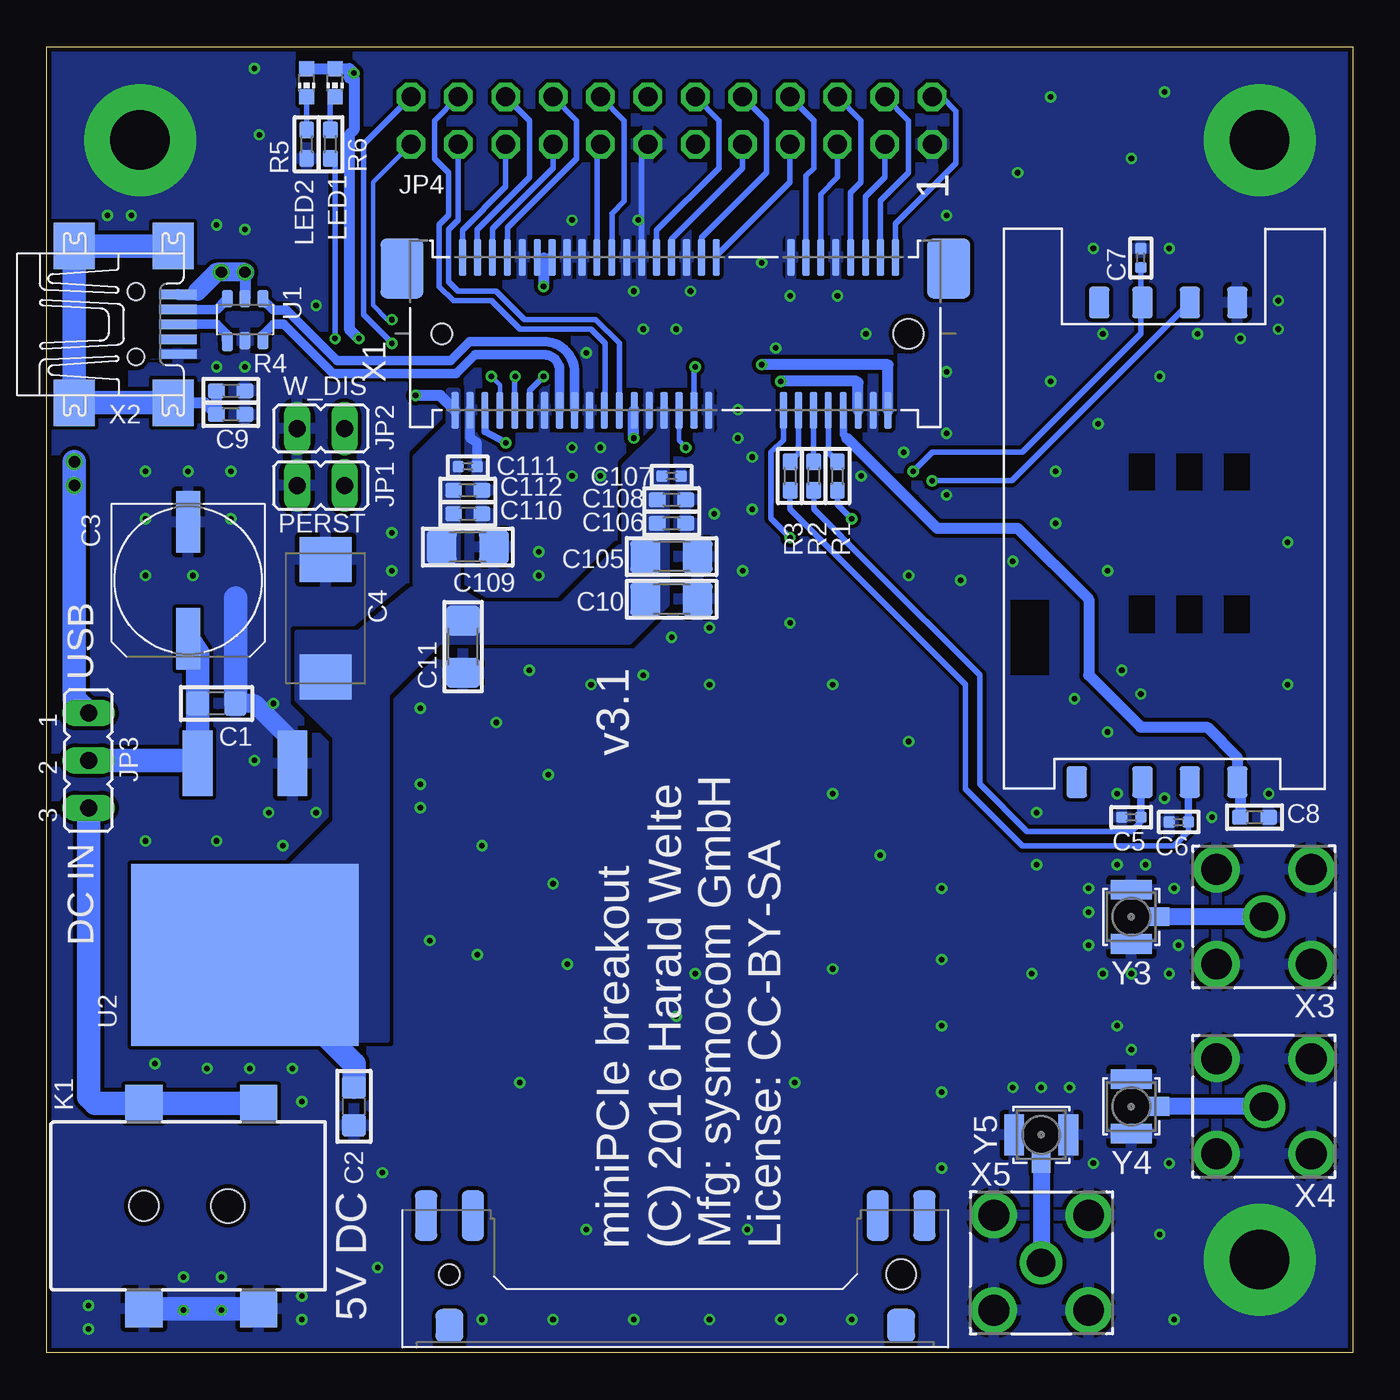
[diagram p2: board, bottom side, seen from below]

Size 70 x 70 mm. Coordinates in mm from the lower left corner, seen from the top.
Outline: 0,0 70,0 70,70 0,70 0,0
Copper layers (1*16): Top 0.035mm / dielectric 1.5mm / Bottom 0.035mm
Design rules "SeeedStudio_2layer_DRU_no_angle_20140221 *": minimum track width 6mil, minimum drill 0.3mm, track to track 6mil, track to pad 6mil, pad to pad 6mil, via to via 6mil, smd to smd 0mil, copper to edge 10mil, drill to drill 10mil, minimum pad ring 10mil, minimum via ring 6mil, stop-mask expansion 2mil, vias tented up to drill 100mil, thermal gap 10mil

### Footprints (pad centres in the part's own frame; a part is rotated, then mirrored left to right if it is on the bottom)
_0805 = smd 1.2 x 1.3: 1 -1.016,0; 2 1.016,0
UD-8X10_NICHICON = smd 3.3 x 1.3: + 3.125,0; - -3.125,0
SMC_E = smd 2.4 x 2.8: + -3.15,0; - 3.15,0
_0402 = smd 0.6 x 0.6: 1 -0.508,0; 2 0.508,0
_0603 = smd 0.9 x 0.8: 1 -0.762,0; 2 0.762,0
1206 = smd 1.6 x 1.8: 1 -1.4,0; 2 1.4,0
JP1 = drill 0.914 long: 1 0,-1.27; 2 0,1.27
JP2 = drill 0.914 long: 1 -2.54,0; 2 0,0; 3 2.54,0
2X12 = drill 1.016 octagon: 1 -13.97,-1.27; 2 -13.97,1.27; 3 -11.43,-1.27; 4 -11.43,1.27; 5 -8.89,-1.27; 6 -8.89,1.27; 7 -6.35,-1.27; 8 -6.35,1.27; 9 -3.81,-1.27; 10 -3.81,1.27; 11 -1.27,-1.27; 12 -1.27,1.27; 13 1.27,-1.27; 14 1.27,1.27; 15 3.81,-1.27; 16 3.81,1.27; 17 6.35,-1.27; 18 6.35,1.27; 19 8.89,-1.27; 20 8.89,1.27; 21 11.43,-1.27; 22 11.43,1.27; 23 13.97,-1.27; 24 13.97,1.27
694108106102 = smd 2 x 2: 1 11.15,5.5; 1-1 5,5.5; 2 5,-5.5; 3 11.15,-5.5 | hole 1.6: 5,0 | hole 1.8: 9.5,0
CHIP-LED0603 = smd 0.8 x 0.8: A 0,-0.75; C 0,0.75
SF7W008S1A-RESTR = smd 1.7 x 1.1: 1 12.85,3.9; 2 12.85,1.36; 3 12.85,-1.18; 5 -12.85,3.9; 6 -12.85,1.36; 7 -12.85,-1.18; 81 12.85,-4.7; 82 -12.85,-3.5
TSOP-6 = smd 0.6 x 1.05: 1 -0.95,-1.175 | smd 0.6 x 0.95: 2 0,-1.125; 3 0.95,-1.125; 4 0.95,1.125; 5 0,1.125; 6 -0.95,1.125
ST_D2PAK = smd 3.5 x 1.6: LEFT 6.7,-2.54; RIGHT 6.7,2.54 | smd 9.75 x 12.2: PAD -3.575,0
MM60-52 = smd 0.4 x 2: 1 0.702,-4.1; 2 1.102,4.1; 3 1.502,-4.1; 4 1.902,4.1; 5 2.302,-4.1; 6 2.702,4.1; 7 3.102,-4.1; 8 3.502,4.1; 9 3.902,-4.1; 10 4.302,4.1; 11 4.702,-4.1; 12 5.102,4.1; 13 5.502,-4.1; 14 5.902,4.1; 15 6.302,-4.1; 16 6.702,4.1; 17 10.302,-4.1; 18 10.702,4.1; 19 11.102,-4.1; 20 11.502,4.1; 21 11.902,-4.1; 22 12.302,4.1; 23 12.702,-4.1; 24 13.102,4.1; 25 13.502,-4.1; 26 13.902,4.1; 27 14.302,-4.1; 28 14.702,4.1; 29 15.102,-4.1; 30 15.502,4.1; 31 15.902,-4.1; 32 16.302,4.1; 33 16.702,-4.1; 34 17.102,4.1; 35 17.502,-4.1; 36 17.902,4.1; 37 18.302,-4.1; 38 18.702,4.1; 39 19.102,-4.1; 40 19.502,4.1; 41 19.902,-4.1; 42 20.302,4.1; 43 20.702,-4.1; 44 21.102,4.1; 45 21.502,-4.1; 46 21.902,4.1; 47 22.302,-4.1; 48 22.702,4.1; 49 23.102,-4.1; 50 23.502,4.1; 51 23.902,-4.1; 52 24.302,4.1 | smd 1.2 x 2.7: M1 -0.848,47.253; M2 1.652,47.253; M4 23.352,47.253; M5 25.852,47.253 | smd 1.5 x 1.8: M3 0.402,53.153; M6 24.602,53.153 | smd 2.3 x 3.2: S1 -2.148,-3.5; S2 27.152,-3.5 | hole 1.6: 0.002,0; 0.402,50.403 | hole 1.1: 25.002,0; 24.602,50.403
UX60-MB-5ST = smd 2 x 0.5: 1 2.25,1.6; 2 2.25,0.8; 3 2.25,0; 4 2.25,-0.8; 5 2.25,-1.6 | smd 2.2 x 2.5: M1 -3.3,-4.2; M2 -3.3,4.2; M3 2,4.2; M4 2,-4.2 | hole 0.9: 0,-1.75; 0,1.75
SMA-F-S-TH = drill 1.524: C 0,0 | drill 1.651: G1 -2.54,2.54; G2 2.54,2.54; G3 -2.54,-2.54; G4 2.54,-2.54
HRS_UFL = smd 1.05 x 2.2: GND@1 -1.452,0; GND@2 1.452,0 | smd 1 x 1.05: SIG 0,-1.502

### Placement (x,y rotation side)
C1  60.89,34.8 180 bottom
C2  53.53,13.21 90 bottom
C3  62.42,41.4 270 bottom
C4  55.05,39.37 90 bottom
C5  11.87,28.7 180 bottom
C6  9.33,28.45 180 bottom
C7  11.36,58.67 90 bottom
C8  5.27,28.7 180 bottom
C9  60.13,50.29 180 bottom
C10  36.51,40.39 180 bottom
C11  47.69,37.85 90 bottom
C105  36.51,42.67 180 bottom
C106  36.51,44.45 180 bottom
C107  36.51,46.99 0 bottom
C108  36.51,45.72 0 bottom
C109  47.43,43.18 180 bottom
C110  47.43,44.96 180 bottom
C111  47.43,47.5 0 bottom
C112  47.43,46.23 0 bottom
JP1  55.31,46.48 90 bottom
JP2  55.31,49.53 270 bottom
JP3  67.75,31.75 270 bottom
JP4  36.51,66.04 0 top
K1  69.78,7.87 0 bottom
LED1  54.54,68.07 180 bottom
LED2  56.07,68.07 180 bottom
R1  27.62,46.99 270 bottom
R2  28.89,46.99 270 bottom
R3  30.16,46.99 270 bottom
R4  60.13,51.56 180 bottom
R5  56.07,64.77 90 bottom
R6  54.8,64.77 270 bottom
SIM1  10.09,43.43 270 bottom
U1  59.37,55.37 0 bottom
U2  59.37,24.89 90 bottom
X1  23.81,54.61 180 bottom
X2  65.21,55.12 0 bottom
X3  4.76,23.37 180 bottom
X4  4.76,13.21 180 bottom
X5  16.7,4.83 0 bottom
Y3  11.87,23.37 90 bottom
Y4  11.87,13.21 90 bottom
Y5  16.7,11.68 0 bottom

### Tracks (layer width: path | path; a pad name or v marks a point on that pad's centre or on a via)
!CLKREQ
  Bottom 0.305: JP4.6 26.35,66.04 26.35,62.74 26.91,62.18 X1.7
_USB_D_N
  Bottom 0.5: X2.2 60.9,55.92 U1.6
_USB_D_P
  Bottom 0.5: X2.3 60.89,55.12 60.39,54.61 60.39,54.26 U1.1
COEX1
  Bottom 0.305: JP4.4 23.81,66.04 23.81,63.25 25.31,61.74 X1.3
COEX2
  Bottom 0.305: JP4.3 25.08,62.99 26.11,61.96 X1.5
GND  (via drill 0.3, 3.2 pad 6)
  Bottom 0.305: JP4.13 38.11,64.44 X1.27
  Bottom 0.5: X1.50 47.31,49.02 46.92,48.77 C111.2
  Bottom 1.016: U2.LEFT 56.83,32.77 58.86,34.8 C1.1
  Bottom 1.27: K1.2 K1.3 | C1.1 59.88,40.46
  other vias: 66.74,60.96 65.47,60.96 60.89,52.83 59.37,52.83 49.97,30.48 49.97,29.21 55.56,28.96 57.34,27.18 58.1,28.96 58.86,31.75 57.85,34.8 60.13,47.24 62.42,47.24 64.7,47.24 56.32,13.46 62.67,4.06 60.64,4.06 56.32,3.05 62.67,2.29 60.64,2.29 40.32,48.51 41.84,48.51 41.08,53.59 32.95,50.55 31.68,58.42 30.16,56.64 27.62,56.64 21.78,60.96 21.78,52.58 21.78,49.28 21.78,45.97 24.06,48.26 26.1,54.61 30.92,53.85 36.26,54.86 32.7,41.91 36.51,38.35 27.87,35.81 34.48,35.81 40.83,35.81 22.03,24.89 22.03,21.08 22.03,17.53 22.03,13.97 22.03,9.91 26.86,1.78 30.67,1.78 34.48,1.78 38.54,1.78 42.86,1.78 46.67,1.78 41.84,60.71 38.29,60.71 38.54,56.9 35.49,56.9 38.03,54.86 40.32,46.99 41.84,46.99 32.19,48.01 32.19,45.21 34.22,44.96 34.48,38.86 26.35,46.99 23.81,41.66 21.02,41.4 32.95,49.02 43.62,41.66 43.62,42.93 27.87,20.57 35.24,20.32 42.1,20.83 36.26,18.03 44.64,14.48 32.45,6.6 41.08,6.6 29.91,14.48 46.92,21.34 67.75,2.54 67.75,1.27 56.32,1.78 5,5 5,65 65,65 9.59,24.89 11.11,26.16 12.63,26.16 14.16,24.89 14.16,23.62 14.16,21.84 11.87,20.32 13.4,20.32 9.84,20.32 9.33,21.84 4.51,29.97 7.55,28.7 10.09,29.72 12.63,29.97 16.95,28.96 16.95,26.16 12.38,36.58 11.36,35.31 14.92,35.05 13.14,33.27 15.94,44.45 18.22,42.42 13.14,41.91 4,56.39 4,54.86 6.03,54.36 8.32,54.61 13.4,54.61 16.19,52.07 10.35,52.32 13.65,49.78 15.94,47.24 9.84,59.18 13.9,59.18 49.97,34.54 44.13,36.58 38.03,36.32 45.91,33.78 43.11,30.99 46.67,27.18 42.86,25.15 49.46,22.1 25.33,26.67 23.81,32.77 27.87,29.97 30.16,39.12 12.63,17.53 15.17,14.22 18.22,14.22 16.7,14.22 11.87,16.26 9.84,10.16 13.9,10.16 17.21,20.32 52.26,4.57 52,9.65 61.4,15.24 56.83,15.24 59.12,15.24 64.2,15.49 60.89,27.43 64.7,27.43 60.13,44.7 64.7,44.7 64.7,41.66 62.16,41.66 60.89,60.45 59.37,60.2 58.61,65.28 58.86,68.83 55.56,56.13 51.5,43.94 51.5,41.91 10.09,67.56 16.19,67.31 11.87,64.01 17.97,63.25 3.49,43.43 3.49,35.81 9.59,1.78 10.35,6.35
  pour Bottom (rank 6): 0,69.85 70.04,69.85 70.04,0 0,0
  pour Top (rank 6): 0,69.85 70.04,69.85 70.04,0 0,0
LDO_IN
  Bottom 1.27: JP3.2 62.07,31.75 U2.RIGHT C1.2 61.91,37.52 C3.+
LED_WLAN  (via drill 0.3)
  Top 0.305: v44.89,52.32 44.89,52.07 45.65,51.31 48.7,51.31 v51.5,54.1
  Bottom 0.305: X1.44 44.91,52.3 v44.89,52.32 | v51.5,54.1 53.02,55.63 53.02,64.77 JP4.24
LED_WPAN  (via drill 0.3)
  Top 0.254: v46.16,52.32 48.45,52.32 v51.5,55.37
  Bottom 0.254: X1.46 45.71,51.87 v46.16,52.32 | v51.5,55.37 51.75,55.37 52.51,56.13 52.51,62.74 JP4.23
N$1
  Bottom 0.305: LED2.C R5.2
N$2
  Bottom 0.305: LED1.C 54.8,67.32 R6.1
N$3  (via drill 0.3)
  Top 0.305: v43.37,52.32 43.37,51.56 44.38,50.55 50.73,50.55 v54.54,54.36
  Bottom 0.305: X1.42 44.11,51.58 v43.37,52.32 | v54.54,54.36 54.54,63.5 54.54,64.01 R6.2
N$5
  Bottom 0.305: X1.10 28.11,48.24 R1.1
N$7
  Bottom 0.9: Y5.SIG X5.C
N$8
  Bottom 0.305: X1.12 28.91,47.77 R2.1
N$9
  Bottom 0.305: X1.14 29.71,48.2 R3.1
N$10
  Bottom 0.6: X2.M4 61.52,50.92 C9.2 R4.2
  Bottom 1.27: X2.M3 X2.M2 X2.M1 X2.M4
N$12
  Bottom 1.27: K1.1 64.2,13.37 K1.1-1 67.41,13.37 67.75,13.72 JP3.3
N$13
  Bottom 0.9: X3.C Y3.SIG
N$14
  Bottom 0.9: X4.C Y4.SIG
PERN0
  Bottom 0.305: JP4.9 32.7,63.5 36.51,59.69 X1.23
PERP0
  Bottom 0.305: JP4.12 33.97,66.04 33.97,63.5 37.31,60.16 X1.25
PERST  (via drill 0.3)
  Top 0.254: JP1.1 54.04,46.74 52.77,48.01 52.77,49.28 52.51,49.53 43.88,49.53 41.08,52.32 36,52.32 35.49,51.82 35.49,48.77 v35.75,48.51
  Bottom 0.254: v35.75,48.51 36.11,48.88 X1.22
PETN0
  Bottom 0.305: JP4.16 39.05,66.04 39.05,61.72 39.71,61.06 X1.31
PETP0
  Bottom 0.305: JP4.15 40.51,64.58 X1.33
REFCLK+
  Bottom 0.305: JP4.8 28.89,66.04 28.89,63.5 29.31,63.08 X1.13
REFCLK-
  Bottom 0.305: JP4.5 27.62,62.99 28.51,62.1 X1.11
RSVRD45
  Bottom 0.305: JP4.18 41.59,66.04 41.59,64.01 45.31,60.29 X1.45
RSVRD47
  Bottom 0.305: JP4.17 42.86,63.5 46.11,60.25 X1.47
RSVRD49
  Bottom 0.305: JP4.20 44.13,66.04 44.13,62.99 46.92,60.2 46.92,59.18 46.91,59.17 X1.49
RSVRD51
  Bottom 0.305: JP4.19 45.4,62.48 47.71,60.17 X1.51
SMB_CLK
  Bottom 0.305: X1.30 39.3,54.1 40.57,55.37 44.38,55.37 45.91,56.9 47.94,56.9 48.45,57.4 48.45,60.2 47.94,60.71 JP4.21
SMB_DATA
  Bottom 0.305: X1.32 40.07,50.56 40.07,54.1 40.83,54.86 44.64,54.86 46.16,56.39 48.19,56.39 48.96,57.15 48.96,60.45 48.45,60.96 48.45,63.25 49.21,64.01 49.21,66.04 JP4.22
UIM_C4
  Bottom 0.305: JP4.10 31.43,66.04 31.43,63.25 34.91,59.76 X1.19
UIM_C8
  Bottom 0.305: JP4.7 30.16,62.74 34.11,58.79 X1.17
USB_D_N
  Bottom 0.5: X1.36 41.71,52.54 arc-90 43.37,54.2 47.32,54.2 48.34,53.18 54.43,53.18 57.13,55.88 57.85,55.88 58.42,56.45 U1.4
USB_D_P
  Bottom 0.5: X1.38 42.51,52.64 arc-90 43.37,53.5 47.03,53.5 48.05,52.48 54.65,52.48 57.29,55.12 57.85,55.12 58.42,54.54 U1.3
USB_VBUS  (via drill 0.61)
  Top 1.27: v68.51,46.48 v68.51,47.75 59.37,55.88 v59.37,57.91 v60.64,57.91
  Bottom 0.6: X2.1 62.09,56.72 61.91,56.9 | v59.37,57.91 U1.5
  Bottom 1.016: 61.91,56.9 60.89,57.91 v59.37,57.91
  Bottom 1.27: JP3.1 68.51,35.05 v68.51,47.75
USIM_CLK
  Bottom 0.305: R2.2 28.89,45.21 25.84,42.16
  Bottom 0.307: 25.84,42.16 20,36.32 20,30.48 17.46,27.94 12.13,27.94 11.87,27.94 11.36,28.45 C5.1
  Bottom 0.406: SIM1.3 11.36,30.49 C5.1
USIM_DATA  (via drill 0.3)
  Top 0.307: v23.56,47.24 26.1,44.7 v26.86,44.7
  Bottom 0.305: R1.2 27.62,45.72
  Bottom 0.307: C7.1 11.36,56.37 SIM1.7 11.36,56.19 11.36,54.61 17.71,48.26 22.54,48.26 v23.56,47.24 | v26.86,44.7 27.62,45.47 27.62,45.72
USIM_POWER
  Bottom 0.406: X1.8 27.31,49.22 27.11,49.02
  Bottom 0.6: 27.11,49.02 22.29,44.2 17.97,44.2 14.16,40.39 14.16,36.32 11.36,33.53 7.81,33.53 6.19,31.91 SIM1.1 6.03,30.42 C8.2
USIM_RESET
  Bottom 0.305: R3.2 30.16,45.21 26.6,41.66
  Bottom 0.307: 26.6,41.66 20.76,35.81 20.76,30.23 17.71,27.18 10.09,27.18 9.59,27.18 8.82,27.94 C6.1
  Bottom 0.406: SIM1.2 8.82,30.49 C6.1
USIM_VPP  (via drill 0.3)
  Top 0.307: v22.54,46.74 25.59,43.69 v30.16,43.69
  Bottom 0.305: X1.16 30.51,48.92 31.18,48.26 31.18,46.48
  Bottom 0.307: SIM1.6 18.28,46.74 v22.54,46.74 | v30.16,43.69 31.18,44.7 31.18,46.48
VCC_3V3  (via drill 0.3)
  Top 0.6: v50.23,51.31 v53.27,54.36 53.4,54.74 50.99,57.15 v43.37,57.15 40.07,53.85 34.99,53.85 34.1,52.96 v31.68,52.96 | JP4.14 37.78,68.33 38.29,68.83 53.27,68.83 v53.53,68.58
  Bottom 0.406: X1.39 X1.41 43.71,58.67 43.37,58.67
  Bottom 0.6: LED2.A LED1.A 53.77,68.82 v53.53,68.58 arc-90 53.78,68.33 53.53,68.33 53.53,65.53 53.78,65.28 53.78,54.86 v53.27,54.36 | X1.52 48.91,51.31 v50.23,51.31 | X1.2 24.91,52.96 v31.68,52.96 | 43.37,58.67 v43.37,57.15
  Bottom 1.27: C2.2 53.53,15.47 U2.PAD
  pour Bottom (no thermals): 36.76,50.55 36.76,49.53 36.76,40.39 39.05,40.39 39.05,47.5 37.27,49.28 37.27,50.55
  pour Bottom (no thermals): 47.94,51.56 47.94,40.89 50.23,40.89 50.23,48.01 48.45,49.78 48.45,51.56
  pour Bottom (no thermals): 39.3,43.18 42.35,40.13 46.67,40.13 47.94,40.89 50.48,40.89 53.27,38.61 56.58,38.61 56.58,35.05 54.54,33.02 54.54,28.45 57.08,25.91 65.21,25.91 65.21,16.76 51.75,16.76 51.75,35.31 48.96,38.1 38.8,38.1 36.76,40.13 36.76,43.18
VDD_1V5  (via drill 0.3)
  Top 0.406: v45.4,48.77 43.37,48.77 42.35,47.75 39.81,47.75 v38.54,49.02
  Top 0.6: v30.67,52.07 33.97,52.07 34.73,51.31 34.73,48.26 35.37,47.62 36.13,47.62 36.64,48.13 36.64,48.51 37.14,49.02 v38.54,49.02
  Bottom 0.406: X1.48 46.51,49.37 v45.4,48.77
  Bottom 0.6: X1.6 26.51,51.98 26.6,52.07 v30.67,52.07 | v38.54,49.02 38.54,50.48 X1.28
W_DISABLE  (via drill 0.3)
  Top 0.305: v35.24,52.83 41.34,52.83 44.13,50.04 53.53,50.04 JP2.2
  Bottom 0.305: X1.20 35.31,52.76 v35.24,52.83
WAKE
  Bottom 0.305: JP4.2 22.03,67.31 21.27,66.55 21.27,63.75 24.51,60.51 X1.1

### Text on the board
bPlace: 1
tNames: miniPCIe breakout | (C) 2016 Harald Welte / Mfg: sysmocom GmbH / License: CC-BY-SA
bNames: W_DIS | PERST | USB | DC IN | 5V DC | (C) 2016 Harald Welte / Mfg: sysmocom GmbH / License: CC-BY-SA | miniPCIe breakout